# Altium schematic sheet 7_power_prot_mon.SchDoc: Bus power control & monitoring
size A4; OrganizationName: Pluton UPV; Address1: Universitat Politècnica; Address2: de València (UPV); Address3: Camí de Vera, València; Address4: Spain; SheetNumber: 12; SheetTotal: 12
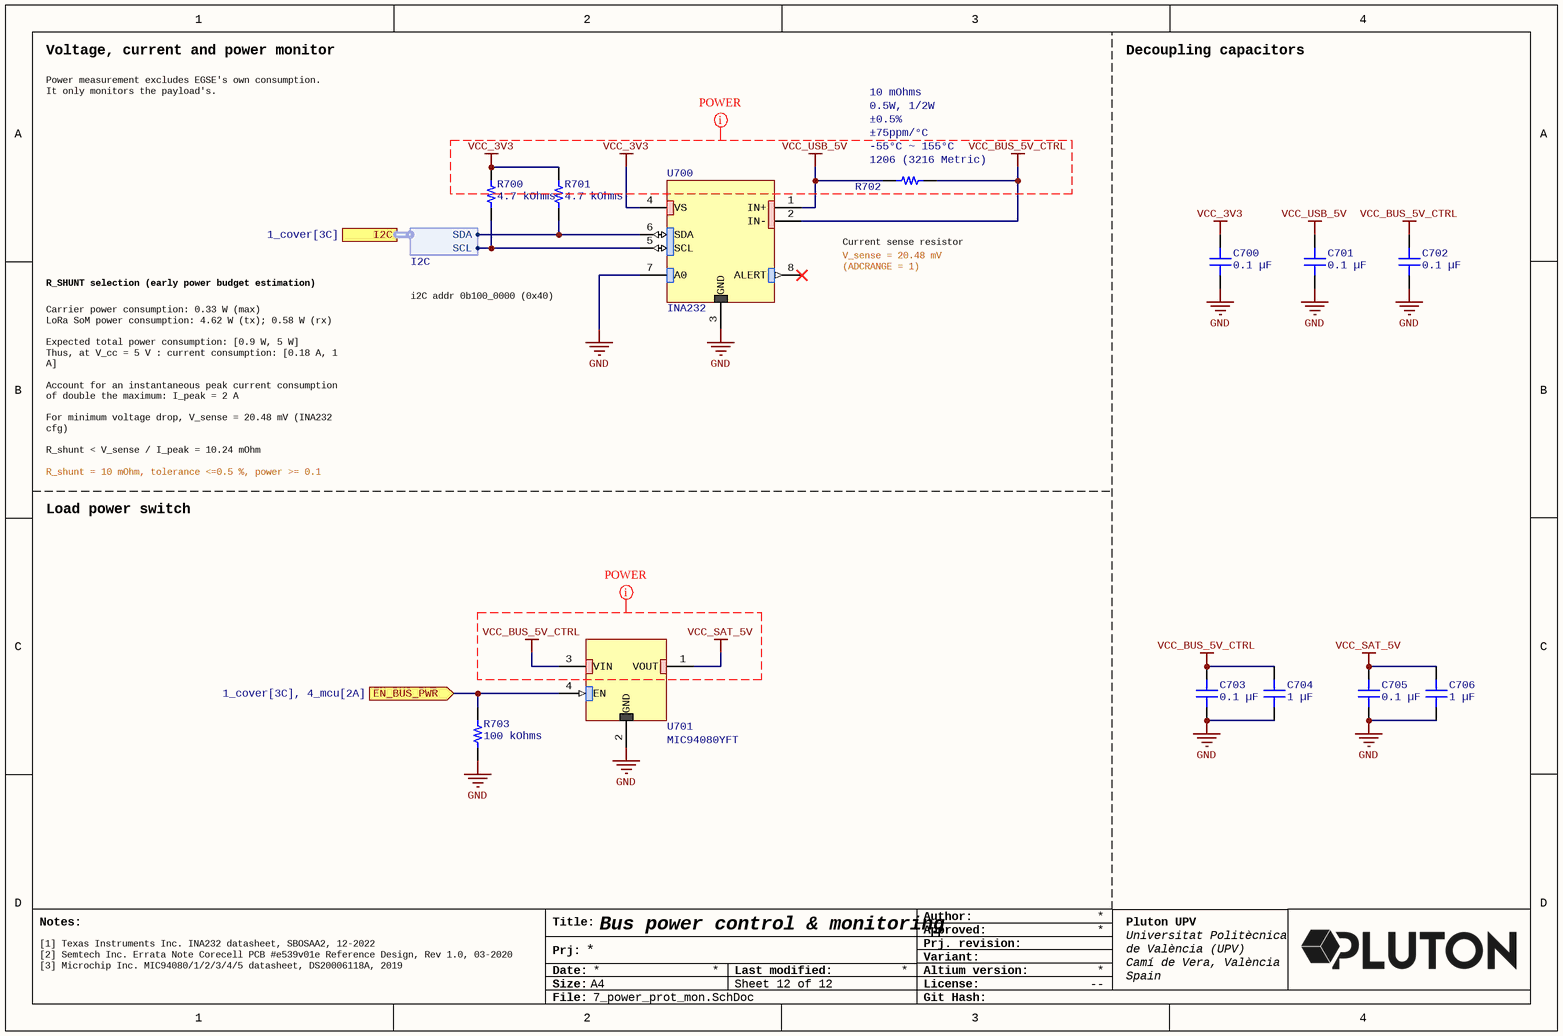
[diagram p0: 7_power_prot_mon.SchDoc]

## Parts
C700  0.1 µF  [CAP 0402_1005]
C701  0.1 µF  [CAP 0402_1005]
C702  0.1 µF  [CAP 0402_1005]
C703  0.1 µF  [CAP 0402_1005]
C704  1 µF  [CAP 0402_1005]
C705  0.1 µF  [CAP 0402_1005]
C706  1 µF  [CAP 0402_1005]
R700  4.7 kOhms  [RES 0201_0603]
R701  4.7 kOhms  [RES 0201_0603]
R702  Package / Case: 1206 (3216 Metric)  Operating Temperature: -55°C ~ 155°C  Power (Watts): 0.5W, 1/2W  Temperature Coefficient: ±75ppm/°C  Tolerance: ±0.5%  [STACKPOLE CSR1206]  (hidden comment: 10 mOhms)
R703  100 kOhms  [RES 0201_0603]
U700  INA232  [SOp-23-8]
U701  MIC94080YFT  [MIC94080YFT]

## Ports
EN_BUS_PWR (in, see 1_cover[3C], 4_mcu[2A]), I2C (harness I2C, see 1_cover[3C])

## Harnesses
I2C: SCL, SDA

## Nets
GND: C700.1 C701.1 C702.1 C703.1 C704.1 C705.1 C706.1 R703.2 U700.3(GND) U700.7(A0) U701.2(GND)
VCC_3V3: C700.2 R700.2 R701.2 U700.4(VS)
VCC_BUS_5V_CTRL: C702.2 C703.2 C704.2 R702.1 U700.2(IN-) U701.3(VIN)
VCC_SAT_5V: C705.2 C706.2 U701.1(VOUT)
VCC_USB_5V: C701.2 R702.2 U700.1(IN+)
EN_BUS_PWR: R703.1 U701.4(EN) ; port EN_BUS_PWR
NetR700_1: R700.1 U700.5(SCL) ; port I2C.SCL
NetR701_1: R701.1 U700.6(SDA) ; port I2C.SDA

Not connected (* = marked no-connect by the designer): U700 8(ALERT)*

## Layout directives
rule Width Constraint [Pref Width = 0.4mm    Min Width = 0.3mm    Max Width = 0.5mm]; net class POWER: VCC_3V3, VCC_BUS_5V_CTRL, VCC_SAT_5V, VCC_USB_5V

## Notes on the sheet
- Voltage, current and power monitor
- Power measurement excludes EGSE's own consumption. It only monitors the payload's.
- Decoupling capacitors
- Current sense resistor
- R_SHUNT selection (early power budget estimation)
- i2C addr 0b100_0000 (0x40)
- V_sense = 20.48 mV (ADCRANGE = 1)
- Carrier power consumption: 0.33 W (max)
  LoRa SoM power consumption: 4.62 W (tx); 0.58 W (rx)
  Expected total power consumption: [0.9 W, 5 W]
  Thus, at V_cc = 5 V : current consumption: [0.18 A, 1 A]
  Account for an instantaneous peak current consumption of double the maximum: I_peak = 2 A
  For minimum voltage drop, V_sense = 20.48 mV (INA232 cfg)
  R_shunt < V_sense / I_peak = 10.24 mOhm
  Power dissipated on R_shunt: 42 mW
- R_shunt = 10 mOhm, tolerance <=0.5 %, power >= 0.1 W
- Load power switch
- [1] Texas Instruments Inc. INA232 datasheet, SBOSAA2, 12-2022
  [2] Semtech Inc. Errata Note Corecell PCB #e539v01e Reference Design, Rev 1.0, 03-2020
  [3] Microchip Inc. MIC94080/1/2/3/4/5 datasheet, DS20006118A, 2019
- Notes:
- Title:
- Author:
- Approved:
- Date:
- Prj:
- Size:
- A4
- Last modified:
- Altium version:
- Variant:
- Prj. revision:
- License:
- --
- File:
- Git Hash:

## Library data of the parts
C700-C703 C705 = C0402C104K4RECAUTO: CAP CER 0402 0.1UF 16V X7R 10%; manufacturer: KEMET; Part Number: C0402C104K4RECAUTO; Value: 0.1 µF; Applications: Automotive, ESD Protection; Capacitance: 0.1 µF; componentlink1description: Datasheet; componentlink1url: https://api.kemet.com/component-edge/download/datasheet/C0402C104K4RECAUTO.pdf; componentlink2description: DigiKey Link; componentlink2url: https://www.digikey.com/en/products/detail/kemet/C0402C104K4RECAUTO/8563695; Device Package: 0402 (1005 Metric); lastupdated: 09/02/2024 20:04:38; Lifecycle Status: Active; Minimum Order: 1; Mounting Type: Surface Mount, MLCC; Operating Temperature: -55°C ~ 125°C; Package / Case: 0402 (1005 Metric); packaging: TapeAndReel; partid: 1731; Part Status: Active; price: 0.01; Ratings: AEC-Q200; series: ESD SMD Auto X7R; Size / Dimension: 0.039" L x 0.020" W (1.00mm x 0.50mm); Supplier 1: DigiKey; Supplier Part Number 1: 399-17167-1-ND; Temperature Coefficient: X7R; Thickness (Max): 0.022" (0.55mm); Tolerance: ±10%; Voltage - Rated: 16V
C704 C706 = GRT155C71A105KE13D: CAP CER 1UF 10V X7S 0402; manufacturer: Murata Electronics; Tolerance: ±10%; Part Number: GRT155C71A105KE13D; Value: 1 µF; Applications: Automotive; Capacitance: 1 µF; componentlink1description: Datasheet; componentlink1url: https://search.murata.co.jp/Ceramy/image/img/A01X/G101/ENG/GRT155C71A105KE13-01.pdf; componentlink2description: DigiKey Link; componentlink2url: https://www.digikey.com/en/products/detail/murata-electronics/GRT155C71A105KE13D/10695747; Device Package: 0402 (1005 Metric); lastupdated: 09/02/2024 20:04:05; Lifecycle Status: Active; Minimum Order: 1; Mounting Type: Surface Mount, MLCC; Operating Temperature: -55°C ~ 125°C; Package / Case: 0402 (1005 Metric); packaging: TapeAndReel; partid: 47127; Part Status: Active; price: 0.04; Ratings: AEC-Q200; series: GRT; Size / Dimension: 0.039" L x 0.020" W (1.00mm x 0.50mm); Supplier 1: DigiKey; Supplier Part Number 1: 490-GRT155C71A105KE13DCT-ND; Temperature Coefficient: X7S; Thickness (Max): 0.024" (0.60mm); Voltage - Rated: 10V
R700 R701 = AC0201FR-074K7L: RES SMD 4.7K OHM 1% 1/20W 0201; Manufacturer: Yageo; Power (Watts): 0.05W, 1/20W; Temperature Coefficient: ±200ppm/°C; Part Number: AC0201FR-074K7L; Value: 4.7 kOhms; ComponentLink1Description: Datasheet; ComponentLink1URL: https://www.yageo.com/upload/media/product/productsearch/datasheet/rchip/PYu-AC_51_RoHS_L_7.pdf; ComponentLink2Description: DigiKey Link; ComponentLink2URL: https://www.digikey.com/en/products/detail/yageo/AC0201FR-074K7L/5894686; Composition: Thick Film; Device Package: 0201 (0603 Metric); Features: Automotive AEC-Q200, Moisture Resistant; Height - Seated (Max): 0.010" (0.26mm); LastUpdated: 04/06/2024 19:11:59; Lifecycle Status: Active; Minimum Order: 1; Number of Terminations: 2; Operating Temperature: -55°C ~ 155°C; Package / Case: 0201 (0603 Metric); Packaging: CutTape; PartId: 978; Part Status: Active; Price: 0.01; Ratings: AEC-Q200; Resistance: 4.7 kOhms; Series: AC; Size / Dimension: 0.024" L x 0.012" W (0.60mm x 0.30mm); Supplier 1: DigiKey; Supplier Part Number 1: YAG3426CT-ND; Supplier Device Package: 0201; Tolerance: ±1%
R702 = L4T12FR010DER: 0.01 OHM 1206 0.5% 0.50W; Manufacturer: Ohmite; Part Number: L4T12FR010DER; ComponentLink1Description: Datasheet; ComponentLink1URL: https://www.ohmite.com/assets/docs/acl_l4t.pdf; ComponentLink2Description: DigiKey Link; ComponentLink2URL: https://www.digikey.com/en/products/detail/ohmite/L4T12FR010DER/10385195; Composition: Thick Film; Device Package: 1206 (3216 Metric); Features: Current Sense; Height - Seated (Max): 0.026" (0.65mm); LastUpdated: 03/06/2024 19:49:34; Lifecycle Status: Active; Minimum Order: 1; Number of Terminations: 4; Packaging: CutTape; PartId: 2184; Part Status: Active; Price: 0.08; Resistance: 10 mOhms; Series: L4T12; Size / Dimension: 0.118" L x 0.063" W (3.00mm x 1.60mm); Supplier 1: DigiKey; Supplier Part Number 1: 273-L4T12FR010DERCT-ND; Supplier Device Package: 1206; Value: 10 mOhms
R703 = RC0201FR-13100KL: RES 100K OHM 1% 1/20W 0201; Manufacturer: Yageo; Power (Watts): 0.05W, 1/20W; Temperature Coefficient: ±200ppm/°C; Part Number: RC0201FR-13100KL; Value: 100 kOhms; ComponentLink1Description: Datasheet; ComponentLink1URL: https://www.yageo.com/upload/media/product/productsearch/datasheet/rchip/PYu-RC_Group_51_RoHS_L_12.pdf; ComponentLink2Description: DigiKey Link; ComponentLink2URL: https://www.digikey.com/en/products/detail/yageo/RC0201FR-13100KL/17014509; Composition: Thick Film; Device Package: 0201 (0603 Metric); Features: Moisture Resistant; Height - Seated (Max): 0.010" (0.26mm); LastUpdated: 04/06/2024 19:11:47; Lifecycle Status: Active; Minimum Order: 1; Number of Terminations: 2; Operating Temperature: -55°C ~ 125°C; Package / Case: 0201 (0603 Metric); Packaging: CutTape; PartId: 80199; Price: 0.01; Resistance: 100 kOhms; Series: RC_L; Size / Dimension: 0.024" L x 0.012" W (0.60mm x 0.30mm); Supplier 1: DigiKey; Supplier Part Number 1: 13-RC0201FR-13100KLCT-ND; Supplier Device Package: 0201; Tolerance: ±1%
U700 = INA232: 48-V, 16-Bit, Current, Voltage, and Power Monitor With an I2C Interface
U701 = MIC94080YFT: 67 mΩ RDS(ON) 2A High-Side Load Switch in 0.85 mm x 0.85 mm FTDFN Package